# Altium schematic sheet M7-Buck_5V.SchDoc
size A4; ApprovedBy: -; CheckedBy: h.t.t.monfared; Author: h.t.t.monfared; Engineer: h.t.t.monfared; Revision: 1.00; SheetNumber: 7; SheetTotal: 10; Project Code:: UFM Sensor Controller; Document Title:: SMPS Buck 5V
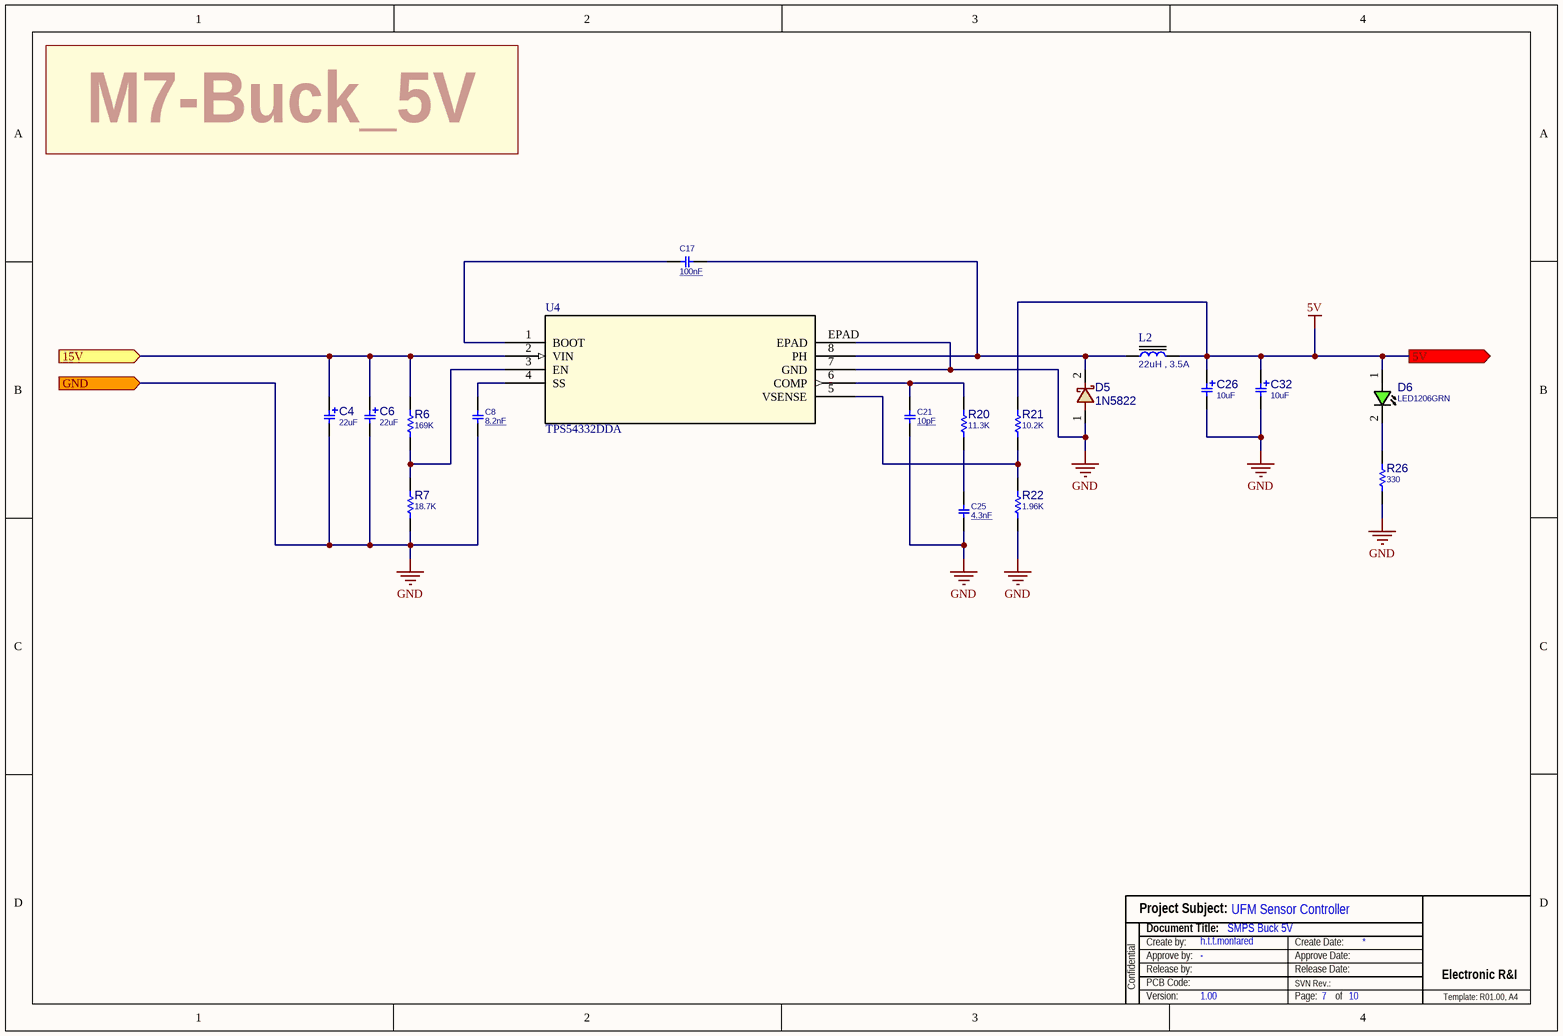
[diagram p0: M7-Buck_5V.SchDoc]

## Parts
C4  22uF  [C1206]
C6  22uF  [C1206]
C8  8.2nF  [C1206]
C17  100nF  [C1206]
C21  10pF  [C1206]
C25  4.3nF  [C1206]
C26  10uF  [C1206]
C32  10uF  [C1206]
D5  1N5822  [D_AX06_DO27]
D6  LED1206GRN  [LED1206GRN]
L2  22uH , 3.5A  [L_12]
R6  169K  [R1206]
R7  18.7K  [R1206]
R20  11.3K  [R1206]
R21  10.2K  [R1206]
R22  1.96K  [R1206]
R26  330  [R1206]
U4  TPS54332DDA  [SO_8T]

## Ports
5V (out), 15V (in), GND (in)

## Nets
5V: C26.1 C32.1 D6.1(ANODE) L2.2 R21.2 ; port 5V
GND: C4.2 C6.2 C8.1 C21.1 C25.1 C26.2 C32.2 D5.1(A) R7.1 R22.1 R26.1 U4.7(GND) U4.EPAD ; port GND
15V: C4.1 C6.1 R6.2 U4.2(VIN) ; port 15V
NetC8_2: C8.2 U4.4(SS)
NetC17_1: C17.1 U4.1(BOOT)
NetC17_2: C17.2 D5.2(K) L2.1 U4.8(PH)
NetC21_2: C21.2 R20.2 U4.6(COMP)
NetC25_2: C25.2 R20.1
NetD6_2: D6.2(CATHODE) R26.2
NetR6_1: R6.1 R7.2 U4.3(EN)
NetR21_1: R21.1 R22.2 U4.5(VSENSE)

## Notes on the sheet
- M7-Buck_5V
- Project Subject:
- Confidential
- Release by:
- Document Title:
- Create by:
- PCB Code:
- Approve by:
- SVN Rev.:
- Create Date:
- Release Date:
- Approve Date:
- Electronic R&I
- Version:
- Page:
- of
- Template: R01.00, A4

## Library data of the parts
C4 C6 C26 C32 = CAP_SMD_EL: CAP, THD, ELEC,; MANF_P#: MANF_PART#; PARAM2: 20%; DESC: DESCRIPTION; DIST#: MOUSER; PARAM: 25V; PRICE: 10= 5$; MANF: MANF; ASSEMBLY: ASSEMBLY
  C4 C6: VALUE: 22uF
  C26 C32: VALUE: 10uF
C8 C17 C21 C25 = CAP_SMD_MLCC: CAP, MLCC, 1nF, 50V, C0G, 10%, 0402; MANF_P#: MANF_PART#; MANF: Murata; PARAM: 50V; PRICE: 100= 1$; DESC: CAP, MLCC, 1nF, 50V, C0G, 10%, 0402; PARAM2: C0G, 10%; ASSEMBLY: ASSEMBLY
  C8: VALUE: 8.2nF
  C17: VALUE: 100nF
  C21: VALUE: 10pF
  C25: VALUE: 4.3nF
D5 = DIODE_THD_SCHOTTKY_1N5822: DIODE, SCHOTTKY, 40V, 3A; MANF: Diodes; DESC: DESCRIPTION; MANF_P#: 1N5822; ASSEMBLY: ASSEMBLY; PRICE: PRICE; PARAM2: 3A; PARAM: 40V; VALUE: 1N5822
D6 = LED_SMD_1206_GRN: LED, SMD, 1206, GREEN; PARAM: 20mA; DESC: DESCRIPTION; PARAM2: 2.2V; MANF: -; ASSEMBLY: ASSEMBLY; PRICE: 36t@Javan; MANF_P#: -; VALUE: LED1206GRN
L2 = IND_THD: INDUCTOR, THD; VALUE: 22uH , 3.5A
R6 R7 R20-R22 R26 = RES_SMD: RESISTOR, SMD; MANF_P#: RK73H1ETTP4701F; MANF: KOA SPEER; PARAM: 0.063W; DESC: DESCRIPTION; DIST#: MOUSER; PARAM2: 1%; ASSEMBLY: ASSEMBLY; PRICE: 100= 0.5$
  R6: VALUE: 169K
  R7: VALUE: 18.7K
  R20: VALUE: 11.3K
  R21: VALUE: 10.2K
  R22: VALUE: 1.96K
  R26: VALUE: 330
U4 = TPS54332DDA: No Description Available; Mfr_Name: Texas Instruments; Copyright: Copyright (C) 2022 Ultra Librarian. All rights reserved.; Manufacturer_Part_Number: TPS54332DDA; RefDes: RefDes; Type: Type